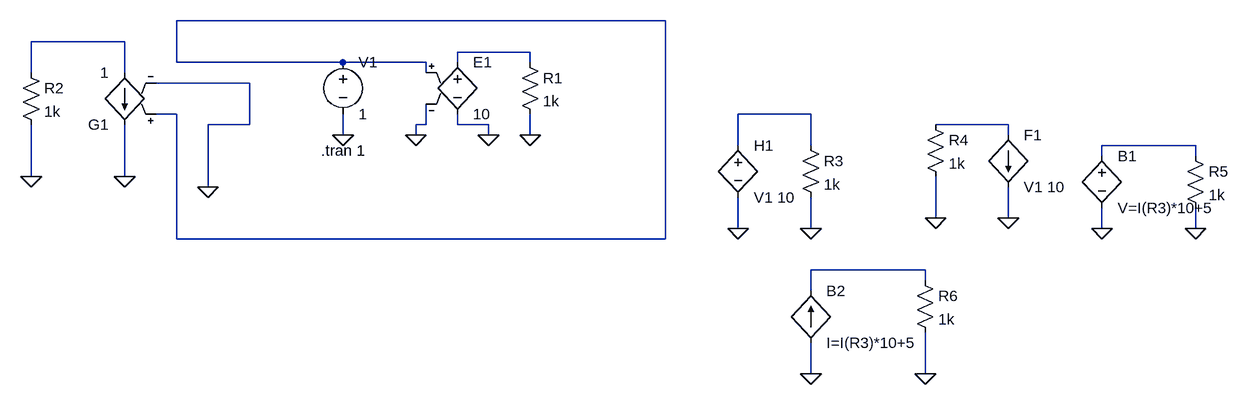
[diagram p0: schematic L7 Task1.asc]
L7 Task1.asc, the LTspice schematic file:
Version 4
SHEET 1 1384 680
WIRE 512 48 -240 48
WIRE -320 80 -464 80
WIRE 304 96 192 96
WIRE -240 112 -240 48
WIRE 16 112 -240 112
WIRE 144 112 16 112
WIRE 192 112 192 96
WIRE 304 112 304 96
WIRE -464 128 -464 80
WIRE -320 128 -320 80
WIRE 144 128 144 112
WIRE -128 144 -272 144
WIRE -240 192 -272 192
WIRE 736 192 624 192
WIRE -128 208 -128 144
WIRE -128 208 -192 208
WIRE 144 208 144 176
WIRE 144 208 128 208
WIRE 192 208 192 192
WIRE 240 208 192 208
WIRE 1040 208 928 208
WIRE 16 224 16 192
WIRE 128 224 128 208
WIRE 240 224 240 208
WIRE 304 224 304 192
WIRE 1040 224 1040 208
WIRE 624 240 624 192
WIRE 736 240 736 192
WIRE 1328 240 1184 240
WIRE 1184 256 1184 240
WIRE 1328 256 1328 240
WIRE -464 288 -464 208
WIRE -320 288 -320 208
WIRE -192 304 -192 208
WIRE 928 352 928 288
WIRE 1040 352 1040 304
WIRE 624 368 624 320
WIRE 736 368 736 320
WIRE 1184 368 1184 336
WIRE 1328 368 1328 336
WIRE -240 384 -240 192
WIRE 512 384 512 48
WIRE 512 384 -240 384
WIRE 912 432 736 432
WIRE 912 448 912 432
WIRE 736 464 736 432
WIRE 736 592 736 544
WIRE 912 592 912 528
FLAG 16 224 0
FLAG 128 224 0
FLAG 240 224 0
FLAG 304 224 0
FLAG -464 288 0
FLAG -320 288 0
FLAG -192 304 0
FLAG 624 368 0
FLAG 736 368 0
FLAG 928 352 0
FLAG 1040 352 0
FLAG 1184 368 0
FLAG 1328 368 0
FLAG 736 592 0
FLAG 912 592 0
SYMBOL e 192 96 R0
SYMATTR InstName E1
SYMATTR Value 10
SYMBOL res 288 96 R0
SYMATTR InstName R1
SYMATTR Value 1k
SYMBOL voltage 16 96 R0
WINDOW 123 0 0 Left 0
WINDOW 39 0 0 Left 0
SYMATTR InstName V1
SYMATTR Value 1
SYMBOL g -320 224 R180
SYMATTR InstName G1
SYMATTR Value 1
SYMBOL res -480 112 R0
SYMATTR InstName R2
SYMATTR Value 1k
SYMBOL h 624 224 R0
SYMATTR InstName H1
SYMATTR Value V1 10
SYMBOL res 720 224 R0
SYMATTR InstName R3
SYMATTR Value 1k
SYMBOL f 1040 224 R0
SYMATTR InstName F1
SYMATTR Value V1 10
SYMBOL res 912 192 R0
SYMATTR InstName R4
SYMATTR Value 1k
SYMBOL bv 1184 240 R0
SYMATTR InstName B1
SYMATTR Value V=I(R3)*10+5
SYMBOL res 1312 240 R0
SYMATTR InstName R5
SYMATTR Value 1k
SYMBOL bi2 736 464 R0
SYMATTR InstName B2
SYMATTR Value I=I(R3)*10+5
SYMBOL res 896 432 R0
SYMATTR InstName R6
SYMATTR Value 1k
TEXT -18 248 Left 2 !.tran 1

The netlist it stands for:
* L7 Task1.asc
E1 N003 0 N001 0 10
R1 N003 0 1k
V1 N001 0 1
G1 N002 0 N001 0 1
R2 N002 0 1k
H1 N004 0 V1 10
R3 N004 0 1k
F1 N005 0 V1 10
R4 N005 0 1k
B1 N006 0 V=I(R3)*10+5
R5 N006 0 1k
B2 0 N007 I=I(R3)*10+5
R6 N007 0 1k
.tran 1
.backanno
.end